# Altium schematic sheet 5v_3v3_vr.SchDoc
size A4; SheetNumber: 1; SheetTotal: 1
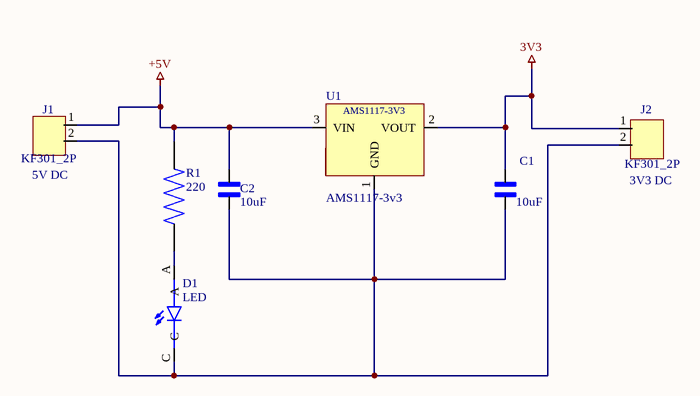
[diagram p0: 5v_3v3_vr.SchDoc]

## Parts
C1  10uF  [CAPC2012X94N]
C2  10uF  [CAPC2012X94N]
D1  LED  [LED_WP7113ID]
J1  KF301_2P  [KF301_2P]
J2  KF301_2P  [KF301_2P]
R1  220  [RESC2012X60N]
U1  AMS1117-3v3  [AMS1117-3V3]

## Nets
3V3: C1.2 J2.1 U1.2(VOUT)
+5V: C2.2 J1.1 R1.1 U1.3(VIN)
NetC1_1: C1.1 C2.1 D1.C J1.2 J2.2 U1.1(GND)
NetD1_A: D1.A R1.2

## Notes on the sheet
- (near J1) 5V DC
- (near J2) 3V3 DC
- (in symbol AMS1117-3v3) AMS1117-3V3

## Library data of the parts
C1 C2 = 0805YC103J4T2A: 10000 pF Â±5% 16V Ceramic Capacitor X7R 0805 (2012 Metric); MF: AVX; SnapEDA_Link: https://www.snapeda.com/parts/0805YC103J4T2A/AVX/view-part/?ref=snap; Package: 2012 AVX; Value: *; MP: 0805YC103J4T2A; Check_prices: https://www.snapeda.com/parts/0805YC103J4T2A/AVX/view-part/?ref=eda
D1 = WP7113ID: Red 617nm LED Indication - Discrete 2V Radial; MF: Kingbright; Price: None; MP: WP7113ID; Package: Radial Kingbright; Check_prices: https://www.snapeda.com/parts/WP7113ID/Kingbright/view-part/?ref=eda; Purchase-URL: https://pricing.snapeda.com/search/part/WP7113ID/?ref=eda; Availability: In Stock; Value: *; SnapEDA_Link: https://www.snapeda.com/parts/WP7113ID/Kingbright/view-part/?ref=snap
R1 = RC0805FR-07910RL: 910 Ohms Â±1% 0.125W, 1/8W Chip Resistor 0805 (2012 Metric) Moisture Resistant Thick Film; MF: Yageo; Package: 2012 Rohm Semiconductor; Value: *; Purchase-URL: https://pricing.snapeda.com/search/part/RC0805FR-07910RL/?ref=eda; Availability: In Stock; MP: RC0805FR-07910RL; Price: None
U1 = AMS1117-3v3: low-dropout (LDO) linear voltage regulator available in fixed and adjustable output versions, designed for reliable low-voltage regulation up to 1A.